# EAGLE design tut-2 (EAGLE 8.4.1)
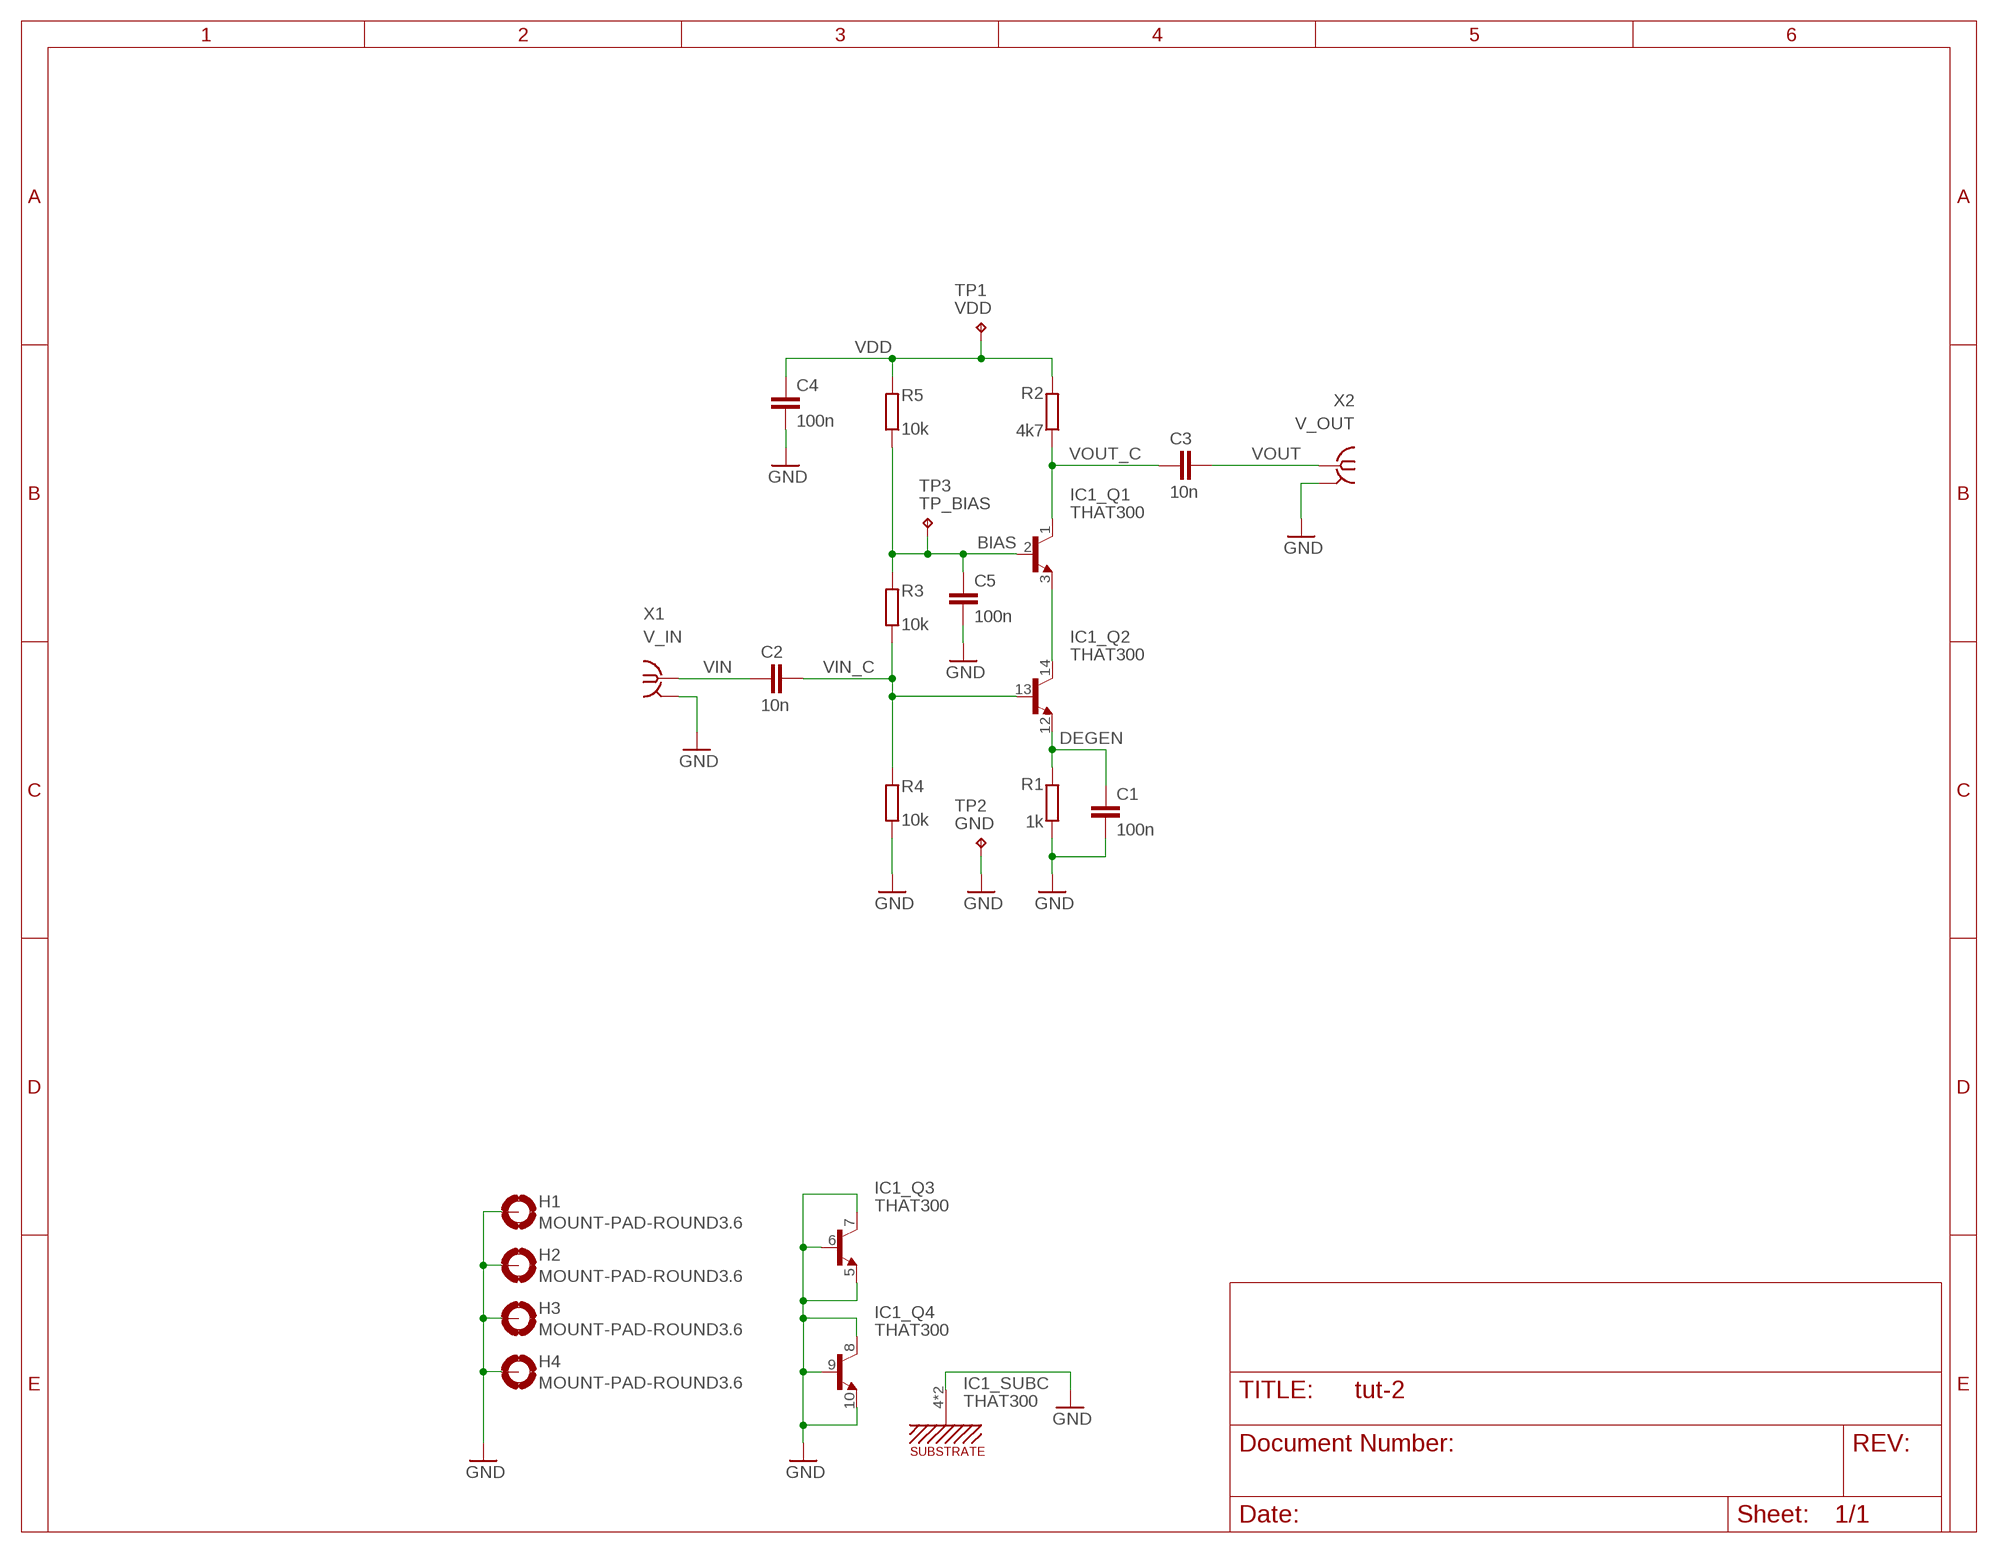
[diagram p0: schematic, sheet 1]

## Parts
C1  100n  C-EU050-025X075  [C050-025X075]
C2  10n  C-EU050-025X075  [C050-025X075]
C3  10n  C-EU050-025X075  [C050-025X075]
C4  100n  C-EU050-025X075  [C050-025X075]
C5  100n  C-EU050-025X075  [C050-025X075]
H1  MOUNT-PAD-ROUND3.6  [3,6-PAD]
H2  MOUNT-PAD-ROUND3.6  [3,6-PAD]
H3  MOUNT-PAD-ROUND3.6  [3,6-PAD]
H4  MOUNT-PAD-ROUND3.6  [3,6-PAD]
IC1  THAT300  [DIL14]
R1  1k  R-EU_0207/7  [0207/7]
R2  4k7  R-EU_0207/7  [0207/7]
R3  10k  R-EU_0207/7  [0207/7]
R4  10k  R-EU_0207/7  [0207/7]
R5  10k  R-EU_0207/7  [0207/7]
TP1  VDD  TESTPOINT  [KEYSTONE_5000_MINIATURE]
TP2  GND  TESTPOINT  [KEYSTONE_5000_MINIATURE]
TP3  TP_BIAS  TESTPOINT  [KEYSTONE_5000_MINIATURE]
X1  V_IN  BU-SMA-H  [BU-SMA-H]
X2  V_OUT  BU-SMA-H  [BU-SMA-H]

## Nets
BIAS: C5.1 IC1.2(_Q1:B) R3.2 R5.1 TP3.P$1
DEGEN: C1.1 IC1.12(_Q2:E) R1.2
GND: C1.2 C4.2 C5.2 H1.B3,6(MOUNT) H2.B3,6(MOUNT) H3.B3,6(MOUNT) H4.B3,6(MOUNT) IC1.4(_SUBC:SUBC) IC1.5(_Q3:E) IC1.6(_Q3:B) IC1.7(_Q3:C) IC1.8(_Q4:C) IC1.9(_Q4:B) IC1.10(_Q4:E) IC1.11(_SUBC:SUBC) R1.1 R4.1 TP2.P$1 X1.2 X1.3 X1.4 X1.5 X2.2 X2.3 X2.4 X2.5
N$4: IC1.3(_Q1:E) IC1.14(_Q2:C)
VDD: C4.1 R2.2 R5.2 TP1.P$1
VIN: C2.1 X1.1
VIN_C: C2.2 IC1.13(_Q2:B) R3.1 R4.2
VOUT: C3.2 X2.1
VOUT_C: C3.1 IC1.1(_Q1:C) R2.1

## Library data of the parts
C1-C5 = rcl:C-EU: CAPACITOR, European symbol
H1-H4 = holes:MOUNT-PAD-ROUND: MOUNTING PAD, round
IC1 = 6301-temp-sensor:THAT300
R1-R5 = rcl:R-EU_: RESISTOR, European symbol
TP1-TP3 = 6301-temp-sensor:TESTPOINT; VALUE: KEYSTONE_5000
X1 X2 = con-coax:BU-SMA-H: FEMALE SMA CONNECTOR Radiall; OC_FARNELL: unknown; OC_NEWARK: unknown

## Board
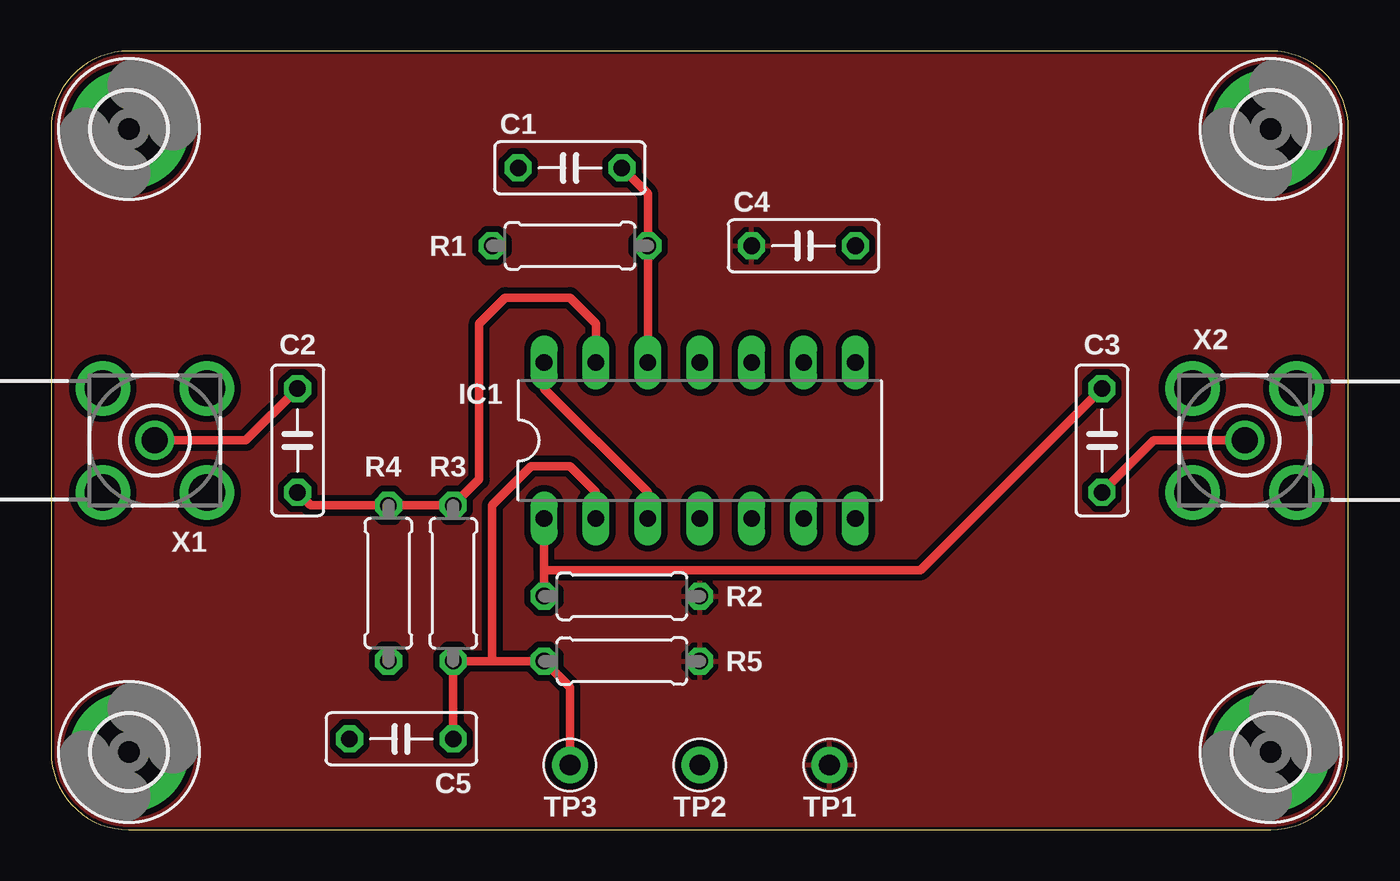
[diagram p1: board, top side]
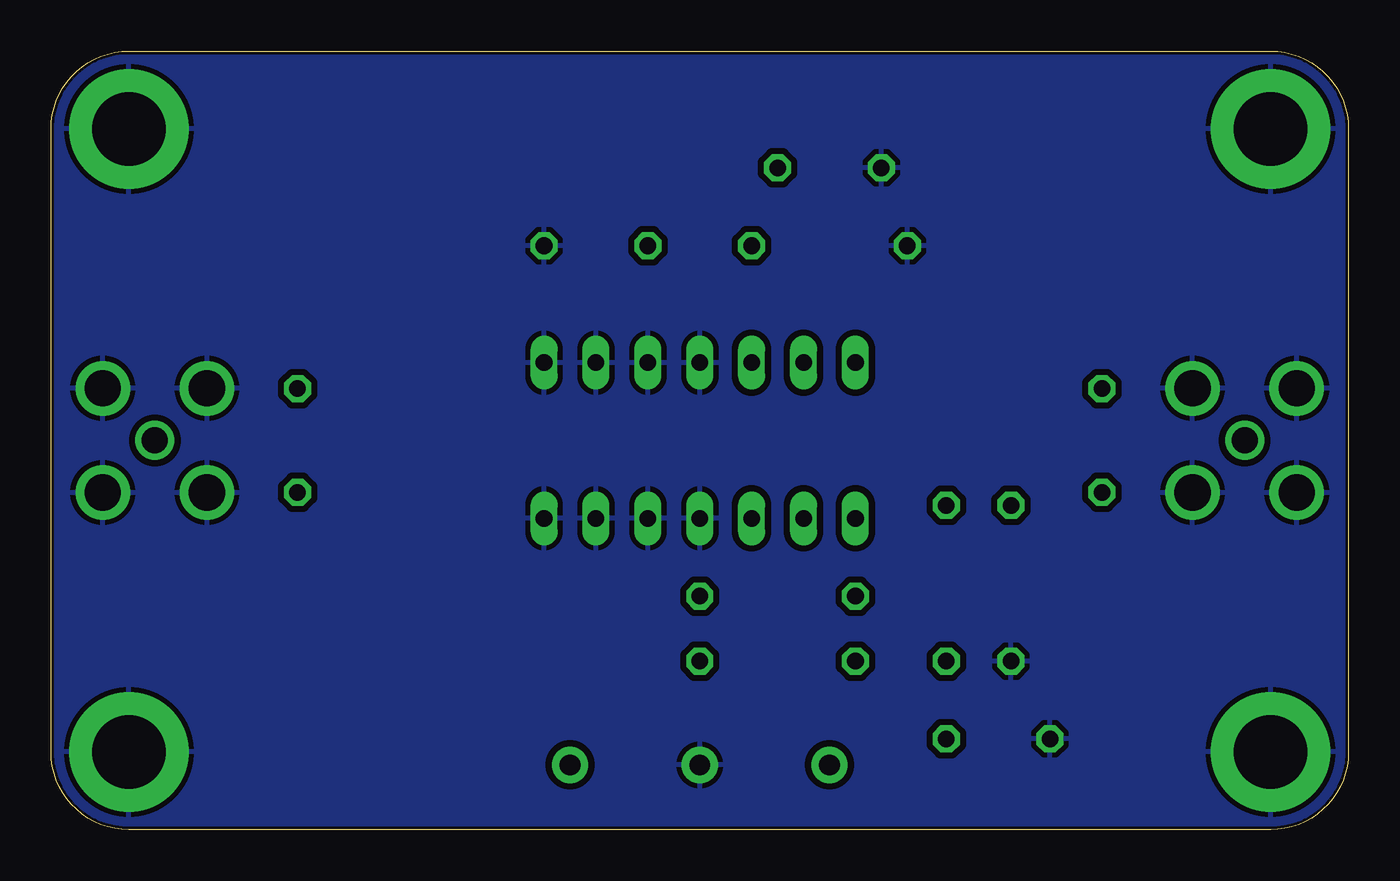
[diagram p2: board, bottom side, seen from below]

Size 63.5 x 38.1 mm. Coordinates in mm from the lower left corner, seen from the top.
Outline: 59.69,38.1 3.81,38.1 arc90 0,34.29 0,3.81 arc90 3.81,0 59.69,0 arc90 63.5,3.81 63.5,34.29 arc90 59.69,38.1
Copper layers (1*16): Top 0.035mm / dielectric 1.5mm / Bottom 0.035mm
Design rules "default *": minimum track width 6mil, minimum drill 0.35mm, track to track 12mil, track to pad 12mil, pad to pad 12mil, via to via 12mil, smd to smd 12mil, copper to edge 6mil, drill to drill 6mil, minimum pad ring 10mil, minimum via ring 8mil, stop-mask expansion 4mil, vias tented up to drill 0mil, thermal gap 10mil

### Footprints (pad centres in the part's own frame; a part is rotated, then mirrored left to right if it is on the bottom)
C050-025X075 = drill 0.813 octagon: 1 -2.54,0; 2 2.54,0
3,6-PAD = drill 3.6 pad 5.842: B3,6 0,0
DIL14 = drill 0.813 long: 1 -7.62,-3.81; 2 -5.08,-3.81; 3 -2.54,-3.81; 4 0,-3.81; 5 2.54,-3.81; 6 5.08,-3.81; 7 7.62,-3.81; 8 7.62,3.81; 9 5.08,3.81; 10 2.54,3.81; 11 0,3.81; 12 -2.54,3.81; 13 -5.08,3.81; 14 -7.62,3.81
0207/7 = drill 0.813 octagon: 1 -3.81,0; 2 3.81,0
KEYSTONE_5000_MINIATURE = drill 1.016 pad 1.778: P$1 0,0
BU-SMA-H = drill 1.27: 1 0,0 | drill 1.778: 2 -2.55,2.55; 3 2.55,2.55; 4 2.55,-2.55; 5 -2.55,-2.55

### Placement (x,y rotation side)
C1  25.4,32.38 180 top
C2  12.06,19.05 270 top
C3  51.44,19.05 270 top
C4  36.83,28.57 0 top
C5  17.14,4.45 180 top
H1  3.81,3.81 0 top
H2  3.81,34.29 0 top
H3  59.69,34.29 0 top
H4  59.69,3.81 0 top
IC1  31.75,19.05 0 top
R1  25.4,28.57 0 top
R2  27.94,11.43 0 top
R3  19.68,12.06 270 top
R4  16.51,12.06 90 top
R5  27.94,8.26 0 top
TP1  38.1,3.17 0 top
TP2  31.75,3.17 0 top
TP3  25.4,3.17 0 top
X1  5.08,19.05 180 top
X2  58.42,19.05 0 top

### Tracks (layer width: path | path; a pad name or v marks a point on that pad's centre or on a via)
BIAS
  Top 0.406: 21.59,8.26 R5.1 25.4,6.99 TP3.P$1 | 21.59,8.26 R3.2 C5.1 | IC1.2 26.67,16.51 25.4,17.78 23.5,17.78 21.59,15.88 21.59,8.26
DEGEN
  Top 0.406: C1.1 29.21,31.11 R1.2 IC1.12
GND
  pour Bottom: 0,38.1 63.5,38.1 63.5,0 0,0
N$4
  Top 0.406: IC1.3 29.21,16.51 24.13,21.59 IC1.14
VDD
  pour Top: 0,38.1 0,0 63.5,0 63.5,38.1
VIN
  Top 0.406: X1.1 9.53,19.05 C2.1
VIN_C
  Top 0.406: C2.2 12.7,15.88 R4.2 R3.1 20.95,17.14 20.95,24.77 22.23,26.04 25.4,26.04 26.35,25.08 | 26.35,25.08 26.67,24.77 | IC1.13 26.67,24.77 | 26.67,24.77 26.35,25.08
VOUT
  Top 0.406: X2.1 53.98,19.05 C3.2
VOUT_C
  Top 0.406: 24.13,12.7 R2.1 | 24.13,12.7 IC1.1 | C3.1 42.55,12.7 24.13,12.7